# Altium schematic sheet ETZ_FIRST.SchDoc: ПЛАТА ЕТЗ
size 420 x 297 mm; ApprovedBy: Мерзлякова Ю.И; CheckedBy: Сидоров М.А; Author: Максим Сидоров; DrawnBy: Сидоров М.А; Address2: 2121; DocumentNumber: Э3; SheetNumber: 1; SheetTotal: 2; Application_BuildNumber: huvvoou
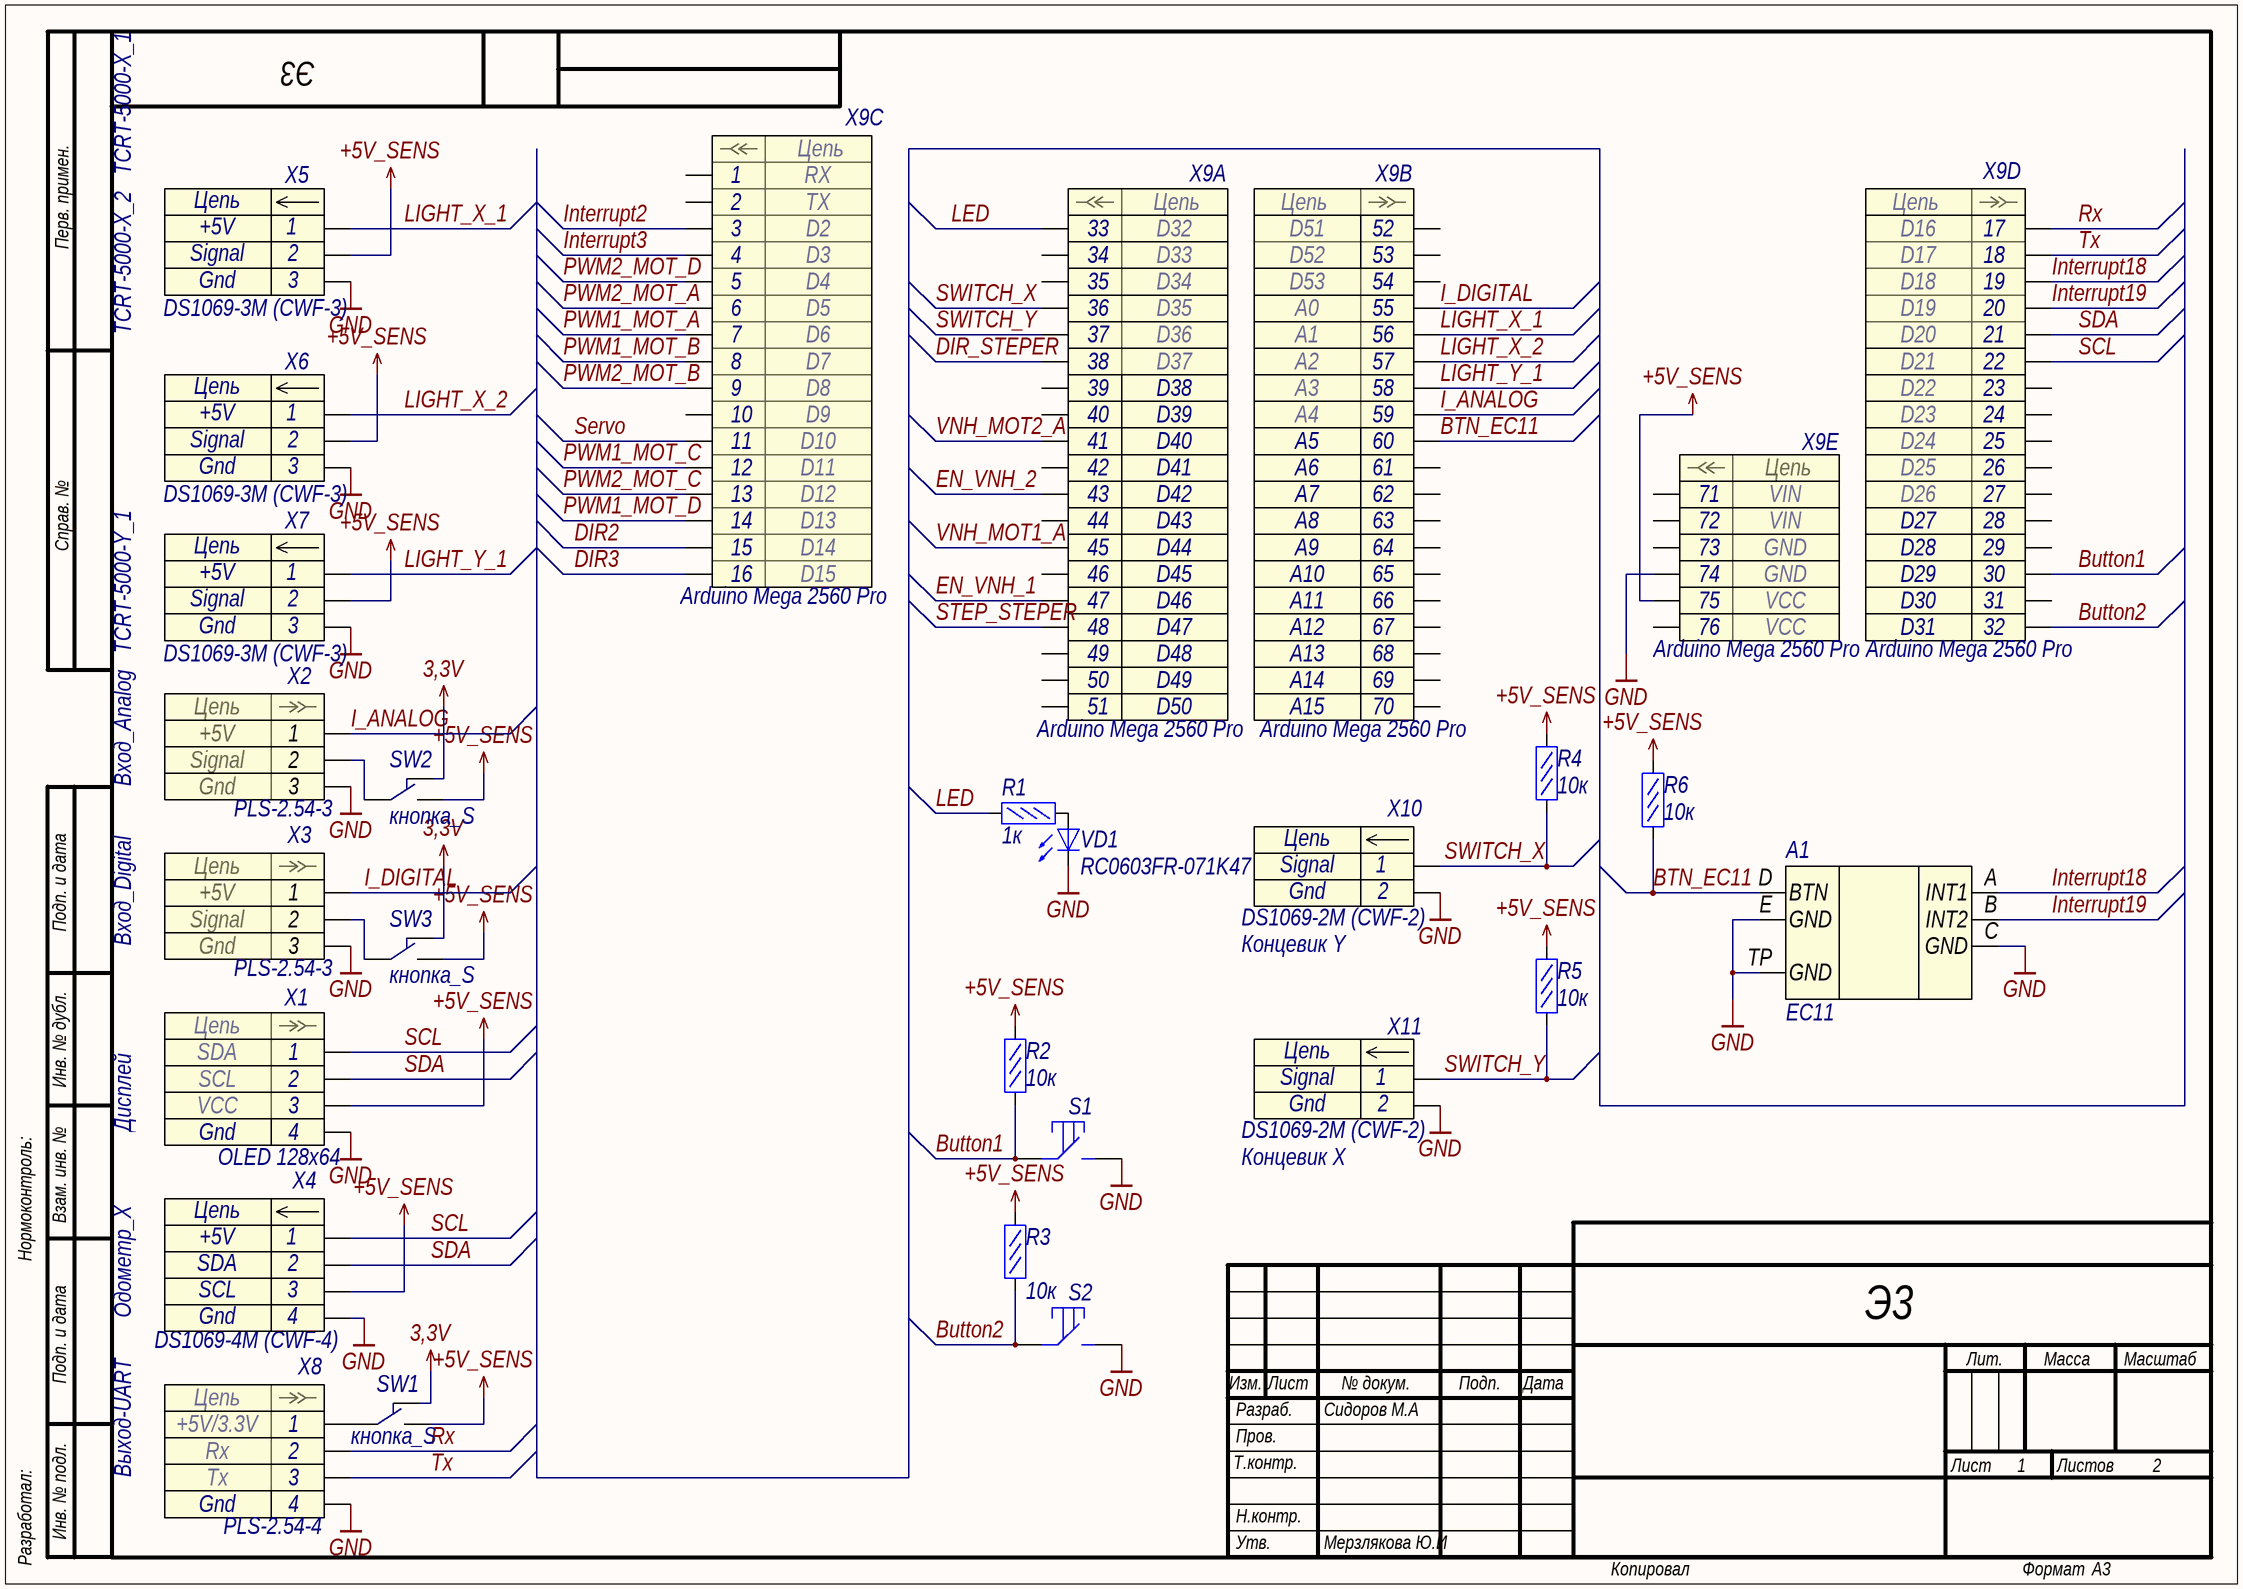
[diagram p0: ETZ_FIRST.SchDoc]

## Parts
A1  EC11  [EC11]
R1  1к  [R0603]
R2  10к  [R0603]
R3  10к  [R0603]
R4  10к  [R0603]
R5  10к  [R0603]
R6  10к  [R0603]
S1  IT-1187  [it-1187]  (value not drawn)
S2  IT-1187  [it-1187]  (value not drawn)
SW1  кнопка_S  [SWITCH]
SW2  кнопка_S  [SWITCH]
SW3  кнопка_S  [SWITCH]
VD1  RC0603FR-071K47  [VD0603]
X1  OLED 128x64  [oled 128x64 0.96inch]
X2  PLS-2.54-3  [PLS-2.54-3]
X3  PLS-2.54-3  [PLS-2.54-3]
X4  DS1069-4M (CWF-4)  [CWF-4]
X5  DS1069-3M (CWF-3)  [CWF-3]
X6  DS1069-3M (CWF-3)  [CWF-3]
X7  DS1069-3M (CWF-3)  [CWF-3]
X8  PLS-2.54-4  [PLS-2.54-4]
X9  Arduino Mega 2560 Pro  [PBD38]  (parts A,B,C,D,E of 5)
X10  DS1069-2M (CWF-2)  [CWF-2]
X11  DS1069-2M (CWF-2)  [CWF-2]

## Nets
3,3V: SW1.3 SW2.3 SW3.3
+5V_SENS: R2.2 R3.2 R4.2 R5.2 R6.2 SW1.1 SW2.1 SW3.1 X1.3 X4.3 X5.2 X6.2 X7.2 X9.75
GND: A1.C(GND) A1.E(GND) A1.TP(GND) S1.2 S2.2 VD1.2(K) X1.4 X2.3 X3.3 X4.4 X5.3 X6.3 X7.3 X8.4 X9.74 X10.2 X11.2
BTN_EC11: A1.D(BTN) R6.1 X9.60
Button1: R2.1 S1.1 X9.30
Button2: R3.1 S2.1 X9.32
DIR2: X9.15
DIR3: X9.16
DIR_STEPER: X9.38
EN_VNH_1: X9.47
EN_VNH_2: X9.43
I_ANALOG: X2.1 X9.59
I_DIGITAL: X3.1 X9.55
Interrupt2: X9.3
Interrupt3: X9.4
Interrupt18: A1.A(INT1) X9.19
Interrupt19: A1.B(INT2) X9.20
LED: R1.1 X9.33
LIGHT_X_1: X5.1 X9.56
LIGHT_X_2: X6.1 X9.57
LIGHT_Y_1: X7.1 X9.58
PWM1_MOT_A: X9.7
PWM1_MOT_B: X9.8
PWM1_MOT_C: X9.12
PWM1_MOT_D: X9.14
PWM2_MOT_A: X9.6
PWM2_MOT_B: X9.9
PWM2_MOT_C: X9.13
PWM2_MOT_D: X9.5
Rx: X8.2 X9.17
SCL: X1.1 X4.1 X9.22
SDA: X1.2 X4.2 X9.21
Servo: X9.11
STEP_STEPER: X9.48
SWITCH_X: R4.1 X9.36 X10.1
SWITCH_Y: R5.1 X9.37 X11.1
Tx: X8.3 X9.18
VNH_MOT1_A: X9.45
VNH_MOT2_A: X9.41
NetR1_2: R1.2 VD1.1(A)
NetSW1_2: SW1.2 X8.1
NetSW2_2: SW2.2 X2.2
NetSW3_2: SW3.2 X3.2

Not connected (* = marked no-connect by the designer): X9 1 2 10 23 24 25 26 27 28 29 31 34 35 39 40 42 44 46 49 50 51 52 53 54 61 62 63 64 65 66 67 68 69 70 71 72 73 76

## Notes on the sheet
- TCRT-5000-X_1
- TCRT-5000-X_2
- TCRT-5000-Y_1
- Вход_Analog
- Вход_Digital
- Концевик Y
- Дисплей
- Концевик X
- Одометр_X
- Выход-UART
- Перв. примен.
- Справ. №
- Подп. и дата
- Инв. № дубл.
- Нормоконтроль:
- Взам. инв. №
- Изм.
- Лист
- № докум.
- Подп.
- Дата
- Лит.
- Масса
- Масштаб
- Т.контр.
- Пров.
- Разраб.
- Листов
- Разработал:
- Инв. № подл.
- Н.контр.
- Утв.
- Копировал
- Формат
- А3
- (in symbol Arduino Mega 2560 Pro, part A) Цепь; D32; D33; D34; D35; D36; D37; D38; D39; D40; D41; D42; D43; D44; D45; D46; D47; D48; D49; D50
- (in symbol Arduino Mega 2560 Pro, part B) Цепь; D51; D52; D53; A0; A1; A2; A3; A4; A5; A6; A7; A8; A9; A10; A11; A12; A13; A14; A15
- (in symbol Arduino Mega 2560 Pro, part C) Цепь; RX; TX; D2; D3; D4; D5; D6; D7; D8; D9; D10; D11; D12; D13; D14; D15
- (in symbol Arduino Mega 2560 Pro, part D) Цепь; D16; D17; D18; D19; D20; D21; D22; D23; D24; D25; D26; D27; D28; D29; D30; D31
- (in symbol Arduino Mega 2560 Pro, part E) Цепь; VIN; GND; VCC
- (in symbol CWF-2) Цепь
- (in symbol CWF-3) Цепь
- (in symbol CWF-4) Цепь
- (in symbol OLED 128x64) Цепь; SDA; SCL; VCC; Gnd
- (in symbol PLS-2.54-3) Цепь
- (in symbol PLS-2.54-4) Цепь

## Library data of the parts
R1 = RC0603FR-071KL: Резистор 1кОм 0,063Вт 1%; Manufacturer: YAGEO; Name: RC0603FR-071KL; Tolerance: 1%; Value: 1к
R2-R6 = RC0603FR-0710KL: Резистор 10кОм 0,063Вт 1%; Manufacturer: YAGEO; Name: RC0603FR-0710KL; Tolerance: 1%; Value: 10к
S1 S2 = IT-1187: тактовая кнопка SMD; Name: IT-1187
SW1-SW3 = BT992895: крутые переключатели с бимов; nam: кнопка_S
VD1 = FYLS-0603BUGC: Светодтод зеленый SMD Foryard Optoelectronics Co.; Name: Зеленый светодиод
X2 X3 = PLS-2.54-3: Contact_1: +5V; Contact_2: Signal; Contact_3: Gnd; nam: PLS-2.54-3
X4 = CWF-4: Разъем - 4 конт. прямая вилка на плату; Contact_1: +5V; Contact_2: SDA; Contact_3: SCL; Contact_4: Gnd; Name: DS1069-4M (CWF-4)
X5-X7 = CWF-3: Разъем - 3 конт. прямая вилка на плату; Contact_1: +5V; Contact_2: Signal; Contact_3: Gnd; Name: DS1069-3M (CWF-3)
X8 = PLS-2.54-4: Contact_1: +5V/3.3V; Contact_2: Rx; Contact_3: Tx; Contact_4: Gnd; nam: PLS-2.54-4
X10 X11 = CWF-2: Разъем - 2 конт. прямая вилка на плату; Contact_1: Signal; Contact_2: Gnd; Name: DS1069-2M (CWF-2)
A1 = EC11: nam: EC11
X9 = Arduino Mega 2560 Pro: nam: Arduino Mega 2560 Pro; Parameter 1: *